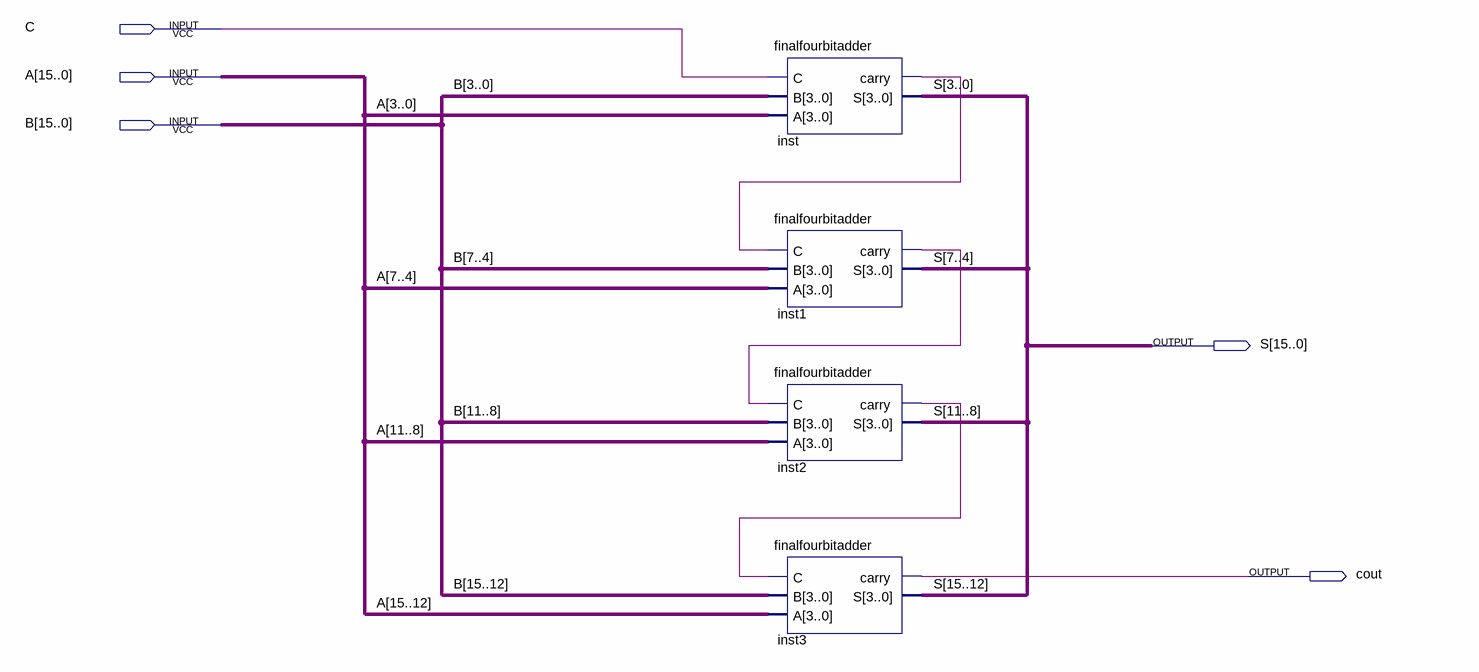
[diagram p0: schematic sheet]
// Quartus schematic onesixadder.bdf as structural Verilog: 4 symbols, 5 pins
module onesixadder (
  input  C,
  input  [15:0] A,
  input  [15:0] B,
  output [15:0] S,
  output cout
);

  wire inst1_carry, inst2_carry, inst_carry;

  finalfourbitadder inst (.C(C), .B(B[3:0]), .A(A[3:0]), .carry(inst_carry), .S(S[3:0]));
  finalfourbitadder inst1 (.C(inst_carry), .B(B[7:4]), .A(A[7:4]), .carry(inst1_carry), .S(S[7:4]));
  finalfourbitadder inst2 (.C(inst1_carry), .B(B[11:8]), .A(A[11:8]), .carry(inst2_carry), .S(S[11:8]));
  finalfourbitadder inst3 (.C(inst2_carry), .B(B[15:12]), .A(A[15:12]), .carry(cout), .S(S[15:12]));
endmodule
